# Altium schematic sheet 3_Auxilaries.SchDoc
size A4
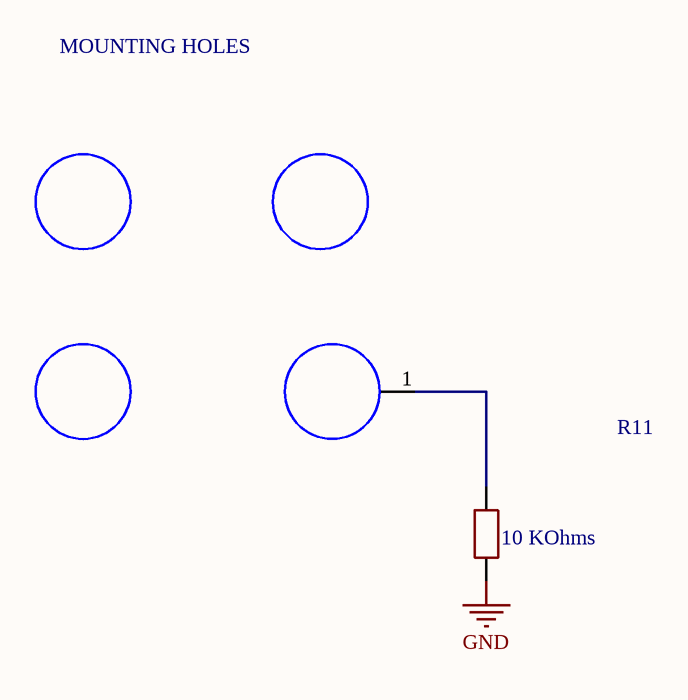
[diagram p0: 3_Auxilaries.SchDoc]

## Parts
H1  M3 not plated  [M3 not plated]  (value not drawn)
H2  M3 not plated  [M3 not plated]  (value not drawn)
H3  M3 not plated  [M3 not plated]  (value not drawn)
H4  M3 plated  [M3 plated]  (value not drawn)
R11  value 10 KOhms  [RES_0603]  (hidden comment: ERJ3GEYJ103V)

## Nets
GND: R11.2
NetH4_1: H4.1 R11.1

## Notes on the sheet
- MOUNTING HOLES

## Library data of the parts
H1-H3 = M3 not plated: M3 hole not plated
H4 = M3 plated: M3 hole plated
R11 = ERJ3GEYJ103V: Res 10KOhms 1/10W 0603; Link: https://www.mouser.ca/ProductDetail/Panasonic/ERJ-3GEYJ103V?qs=66DK8nO8gJBWgc%252B0VNNxzg%3D%3D; Package: 0603; PartNumber: ERJ3GEYJ103V; SupplierPartNumber: 667-ERJ-3GEYJ103V; SuppliersPartNumber: C169849